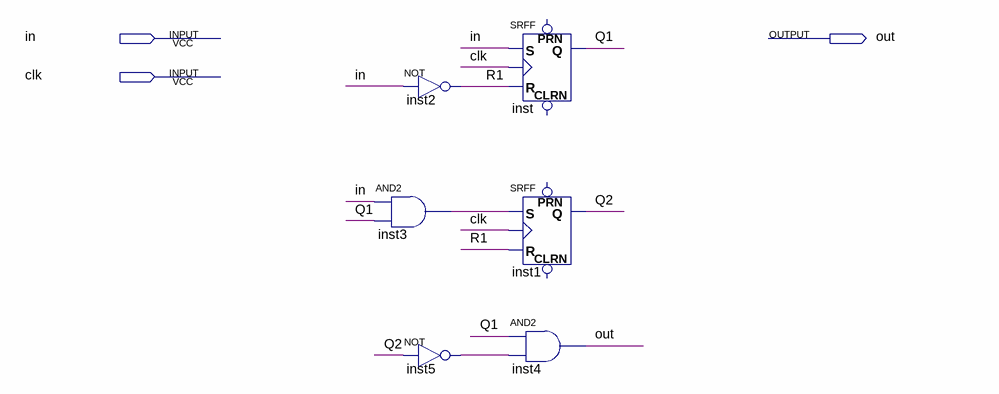
[diagram p0: schematic sheet]
// Quartus schematic RisingEdge.bdf as structural Verilog: 6 symbols, 3 pins
module RisingEdge (
  input  in,
  input  clk,
  output out
);

  wire inst3_out, inst5_out, Q1, Q2, R1;

  not inst2 (R1, in);
  and inst3 (inst3_out, in, Q1);
  not inst5 (inst5_out, Q2);
  SRFF inst (.S(in), .R(R1), .CLK(clk), .Q(Q1));  // open: PRN, CLRN
  SRFF inst1 (.S(inst3_out), .R(R1), .CLK(clk), .Q(Q2));  // open: PRN, CLRN
  and inst4 (out, Q1, inst5_out);
endmodule
